# Altium schematic sheet Logic_DualSupplyOD_HighGND.SchDoc
size A4
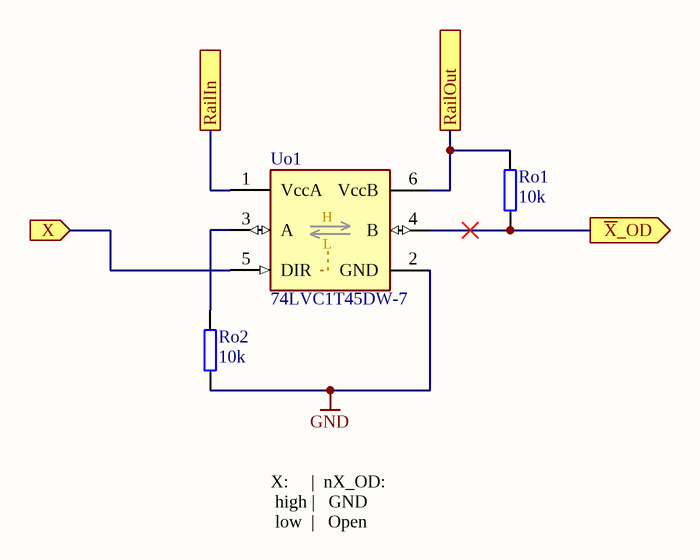
[diagram p0: Logic_DualSupplyOD_HighGND.SchDoc]

## Parts
Ro1  10k  [R_0603_TE]
Ro2  10k  [R_0603_TE]
Uo1  74LVC1T45DW-7  [SOT-363]

## Ports
RailIn, RailOut, X (in), ~{X}_OD (out)

## Nets
GND: Ro2.1 Uo1.2(GND)
RailIn: Uo1.1(VccA) ; port RailIn
RailOut: Ro1.1 Uo1.6(VccB) ; port RailOut
X: Uo1.5(DIR) ; port X
~{X}_OD: Ro1.2 Uo1.4(B) ; port ~{X}_OD
NetRo2_2: Ro2.2 Uo1.3(A)

## Notes on the sheet
- X:     |  nX_OD:
  high |   GND
  low  |   Open
- Title
- Revision:
- Design Engineer:
- Date:
- Project:
- Sheet
- of
- (in symbol 74LVC1T45DW-7) H; L

## Library data of the parts
Ro1 Ro2 = UZgen_R_0603_10k: Generic resistor; Manufacturer: UZgen; Tolerance: 1 %; Created from: AGeiger; Manufacturer Part Number: UZgen_R_0603_10k; PartID: 1; Created On: 02/07/2024 14:34:53; Value: 10k; Device Package: 0603; Mounting Type: SMD; Last Updated: 02/07/2024 14:37:16
Uo1 = 74LVC1T45DW-7: Single-bit Dual Power Supply Translating Transceiver with 3-state Outputs; Manufacturer: Diodes Incorporated; Value: 1.65 - 5.5 V; Created from: MGeier; Manufacturer Part Number: 74LVC1T45DW-7; PartID: 13; Created On: 08/04/2025 19:00:00; ComponentLink1Description: Datasheet; ComponentLink1URL: https://www.diodes.com/datasheet/download/74LVC1T45.pdf; ComponentLink2Description: Cross Reference; ComponentLink2URL: https://www.diodes.com/assets/product-showcases/5825409.pdf#%5B%7B%22num%22%3A1%2C%22gen%22%3A0%7D%2C%7B%22name%22%3A%22Fit%22%7D%5D; ComponentLink3Description: Homepage; ComponentLink3URL: https://www.diodes.com/part/view/74LVC1T45; Component Type: Level Shifter; Device Package: SOT363; Last Updated: 08/04/2025 19:00:00; Mounting Type: SMD; Operating Temperature: –40 to +150 °C; Series: 74LVC1T45; Supplier 1: LCSC; Supplier Part Number 1: C168855; Type: Level Shifter; Live Cycle Status: 1; Stock number: not stored; LCSC Part Number: C168855